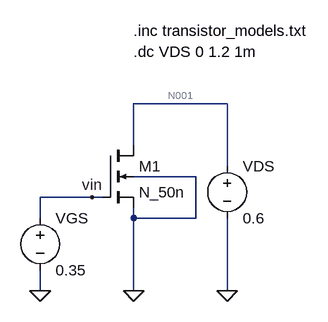
[diagram p0: schematic lab05_nmos_char.asc]
lab05_nmos_char.asc, the LTspice schematic file:
Version 4
SHEET 1 1616 680
WIRE 352 48 208 48
WIRE 208 112 208 48
WIRE 352 144 352 48
WIRE 304 160 208 160
WIRE 144 192 64 192
WIRE 160 192 144 192
WIRE 64 224 64 192
WIRE 208 224 208 208
WIRE 304 224 304 160
WIRE 304 224 208 224
WIRE 64 336 64 304
WIRE 208 336 208 224
WIRE 352 336 352 224
FLAG 208 336 0
FLAG 64 336 0
FLAG 352 336 0
FLAG 144 192 vin
SYMBOL nmos4 160 112 R0
SYMATTR InstName M1
SYMATTR Value N_50n
SYMATTR Value2 l=1u w=10u
SYMBOL voltage 64 208 R0
WINDOW 123 0 0 Left 0
WINDOW 39 0 0 Left 0
SYMATTR InstName VGS
SYMATTR Value 0.35
SYMBOL voltage 352 128 R0
WINDOW 123 0 0 Left 0
WINDOW 39 0 0 Left 0
SYMATTR InstName VDS
SYMATTR Value 0.6
TEXT 208 -64 Left 2 !.inc transistor_models.txt
TEXT 208 -32 Left 2 !.dc VDS 0 1.2 1m

The netlist it stands for:
* lab05_nmos_char.asc
M1 N001 vin 0 0 N_50n l=1u w=10u
VGS vin 0 0.35
VDS N001 0 0.6
.model NMOS NMOS
.model PMOS PMOS
.lib standard.mos
.inc transistor_models.txt
.dc VDS 0 1.2 1m
.backanno
.end

* Results of the author's LTspice run, read from the files saved beside the schematic
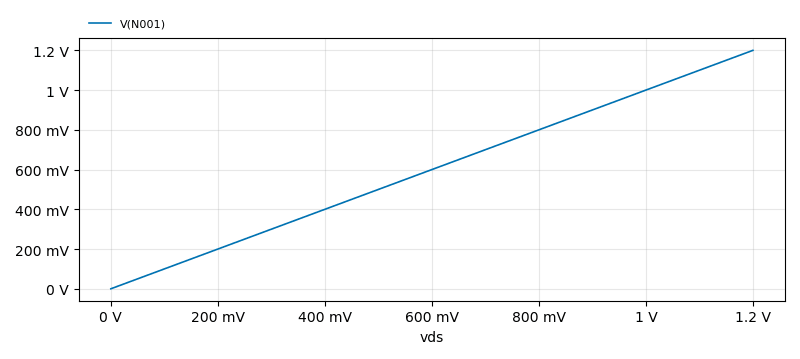
[diagram p1: DC transfer characteristic of lab05_nmos_char.asc, plotted from the saved traces]
* DC transfer characteristic, 1 run:
*   V(N001): 0 V at vds=0 V, 1.2 V at vds=1.2 V, min 0 V, max 1.2 V